# EAGLE design MOS-1 (EAGLE 8.5.2)
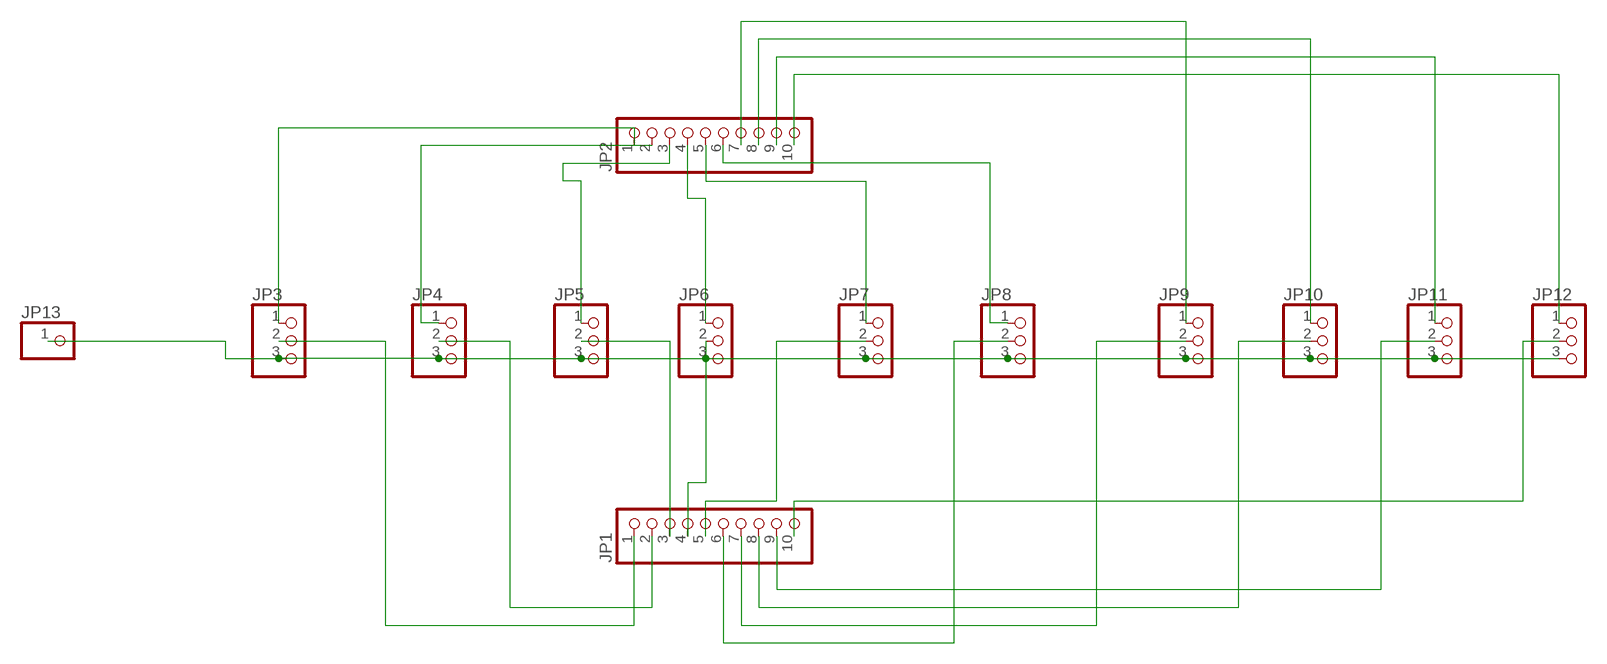
[diagram p0: schematic, sheet 1]

## Parts
JP1  PINHD-1X10  [1X10]
JP2  PINHD-1X10  [1X10]
JP3  PINHD-1X3  [1X03]
JP4  PINHD-1X3  [1X03]
JP5  PINHD-1X3  [1X03]
JP6  PINHD-1X3  [1X03]
JP7  PINHD-1X3  [1X03]
JP8  PINHD-1X3  [1X03]
JP9  PINHD-1X3  [1X03]
JP10  PINHD-1X3  [1X03]
JP11  PINHD-1X3  [1X03]
JP12  PINHD-1X3  [1X03]
JP13  PINHD-1X1  [1X01]

## Nets
N$1: JP3.3 JP4.3 JP5.3 JP6.3 JP7.3 JP8.3 JP9.3 JP10.3 JP11.3 JP12.3 JP13.1
N$2: JP2.1 JP3.1
N$3: JP2.2 JP4.1
N$4: JP2.3 JP5.1
N$5: JP2.4 JP6.1
N$6: JP2.5 JP7.1
N$7: JP2.6 JP8.1
N$8: JP2.7 JP9.1
N$9: JP2.8 JP10.1
N$10: JP2.9 JP11.1
N$11: JP2.10 JP12.1
N$12: JP1.1 JP3.2
N$13: JP1.2 JP4.2
N$14: JP1.3 JP5.2
N$15: JP1.4 JP6.2
N$16: JP1.5 JP7.2
N$17: JP1.6 JP8.2
N$18: JP1.7 JP9.2
N$19: JP1.8 JP10.2
N$20: JP1.9 JP11.2
N$21: JP1.10 JP12.2

## Library data of the parts
JP1 JP2 = pinhead:PINHD-1X10: PIN HEADER
JP3-JP12 = pinhead:PINHD-1X3: PIN HEADER
JP13 = pinhead:PINHD-1X1: PIN HEADER

## Net classes
0 default: width 1 mm, clearance 0.5 mm

## Board
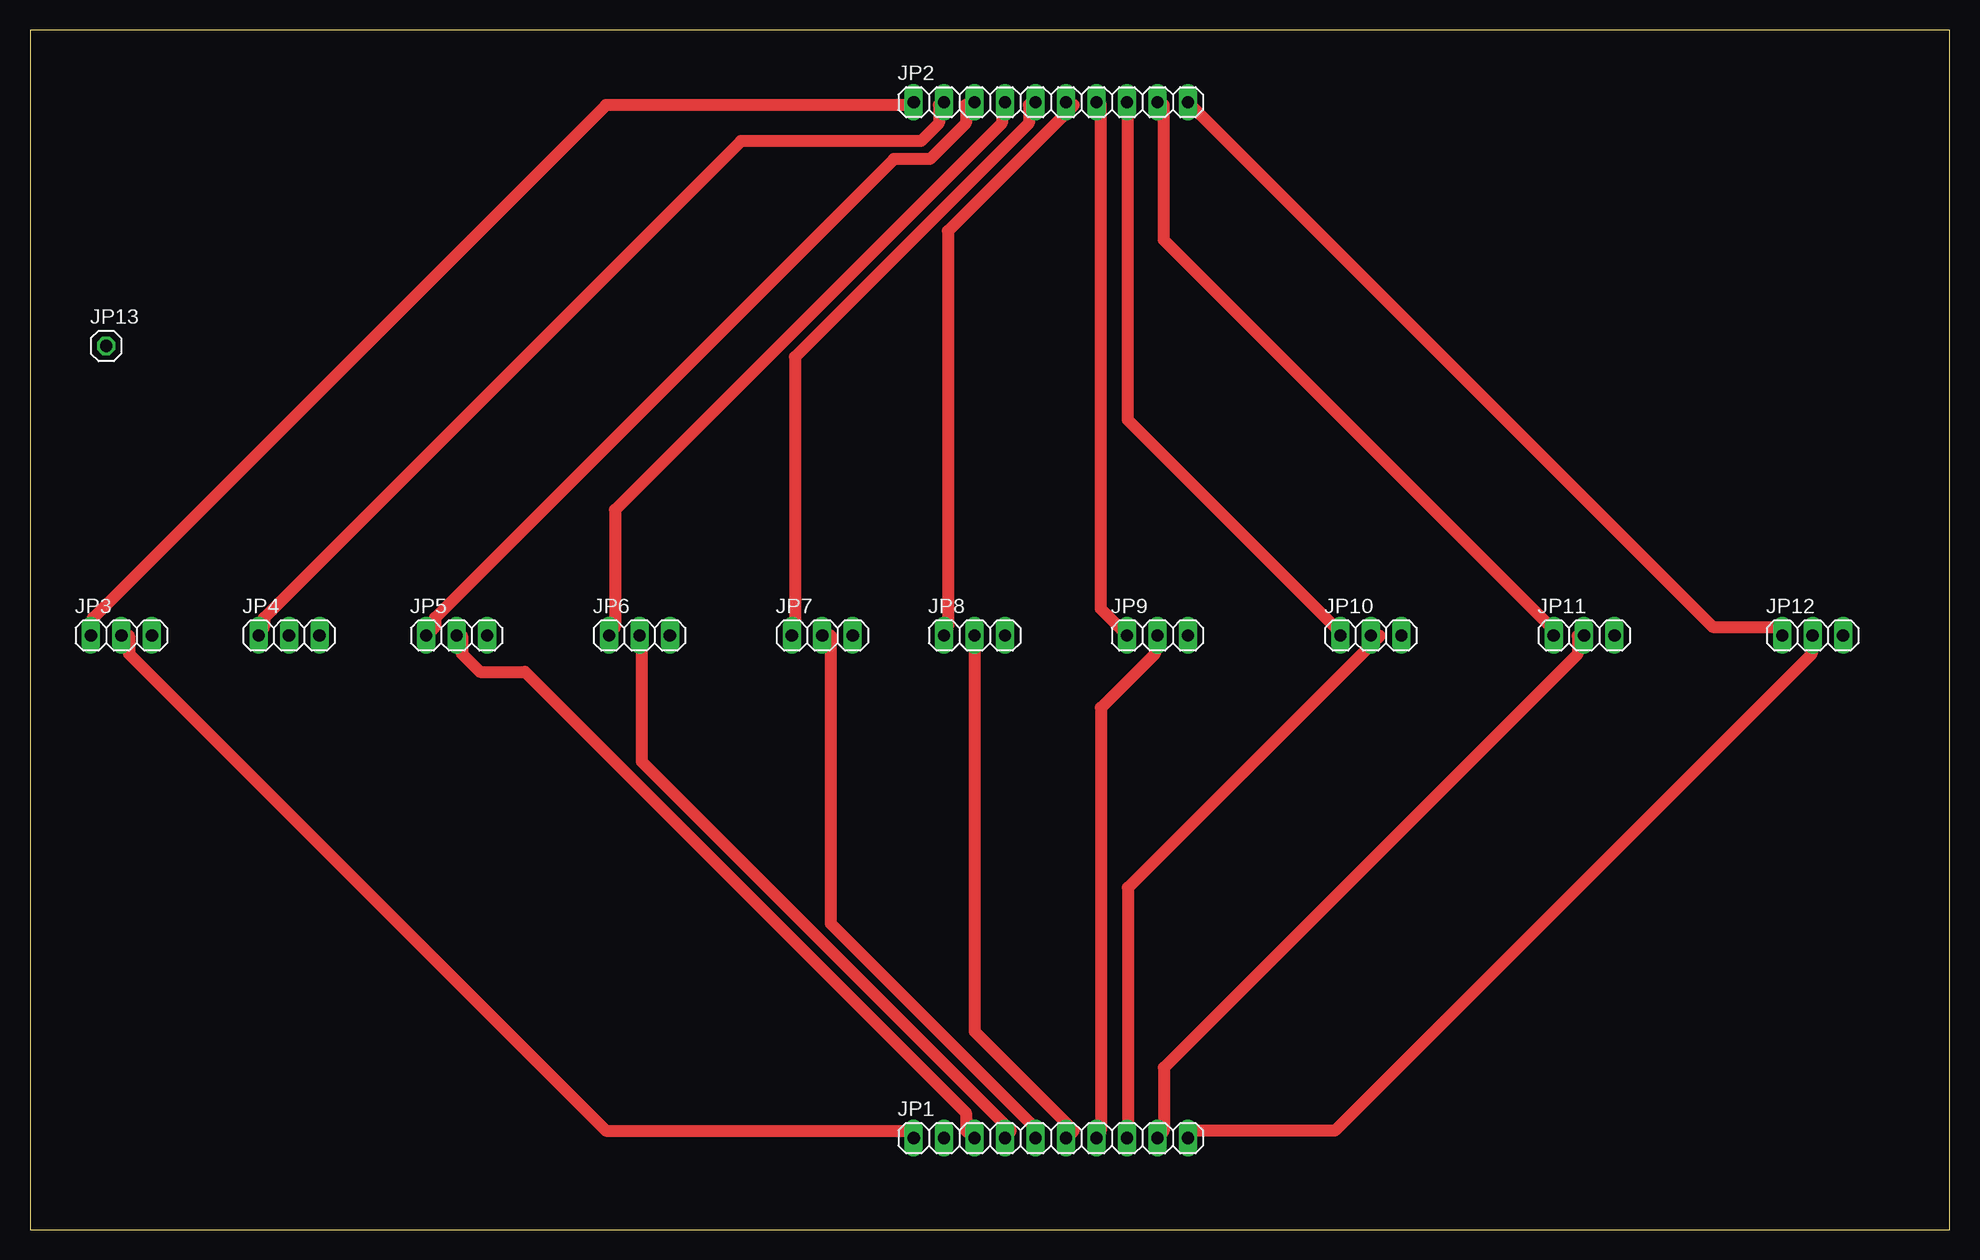
[diagram p1: board, top side]
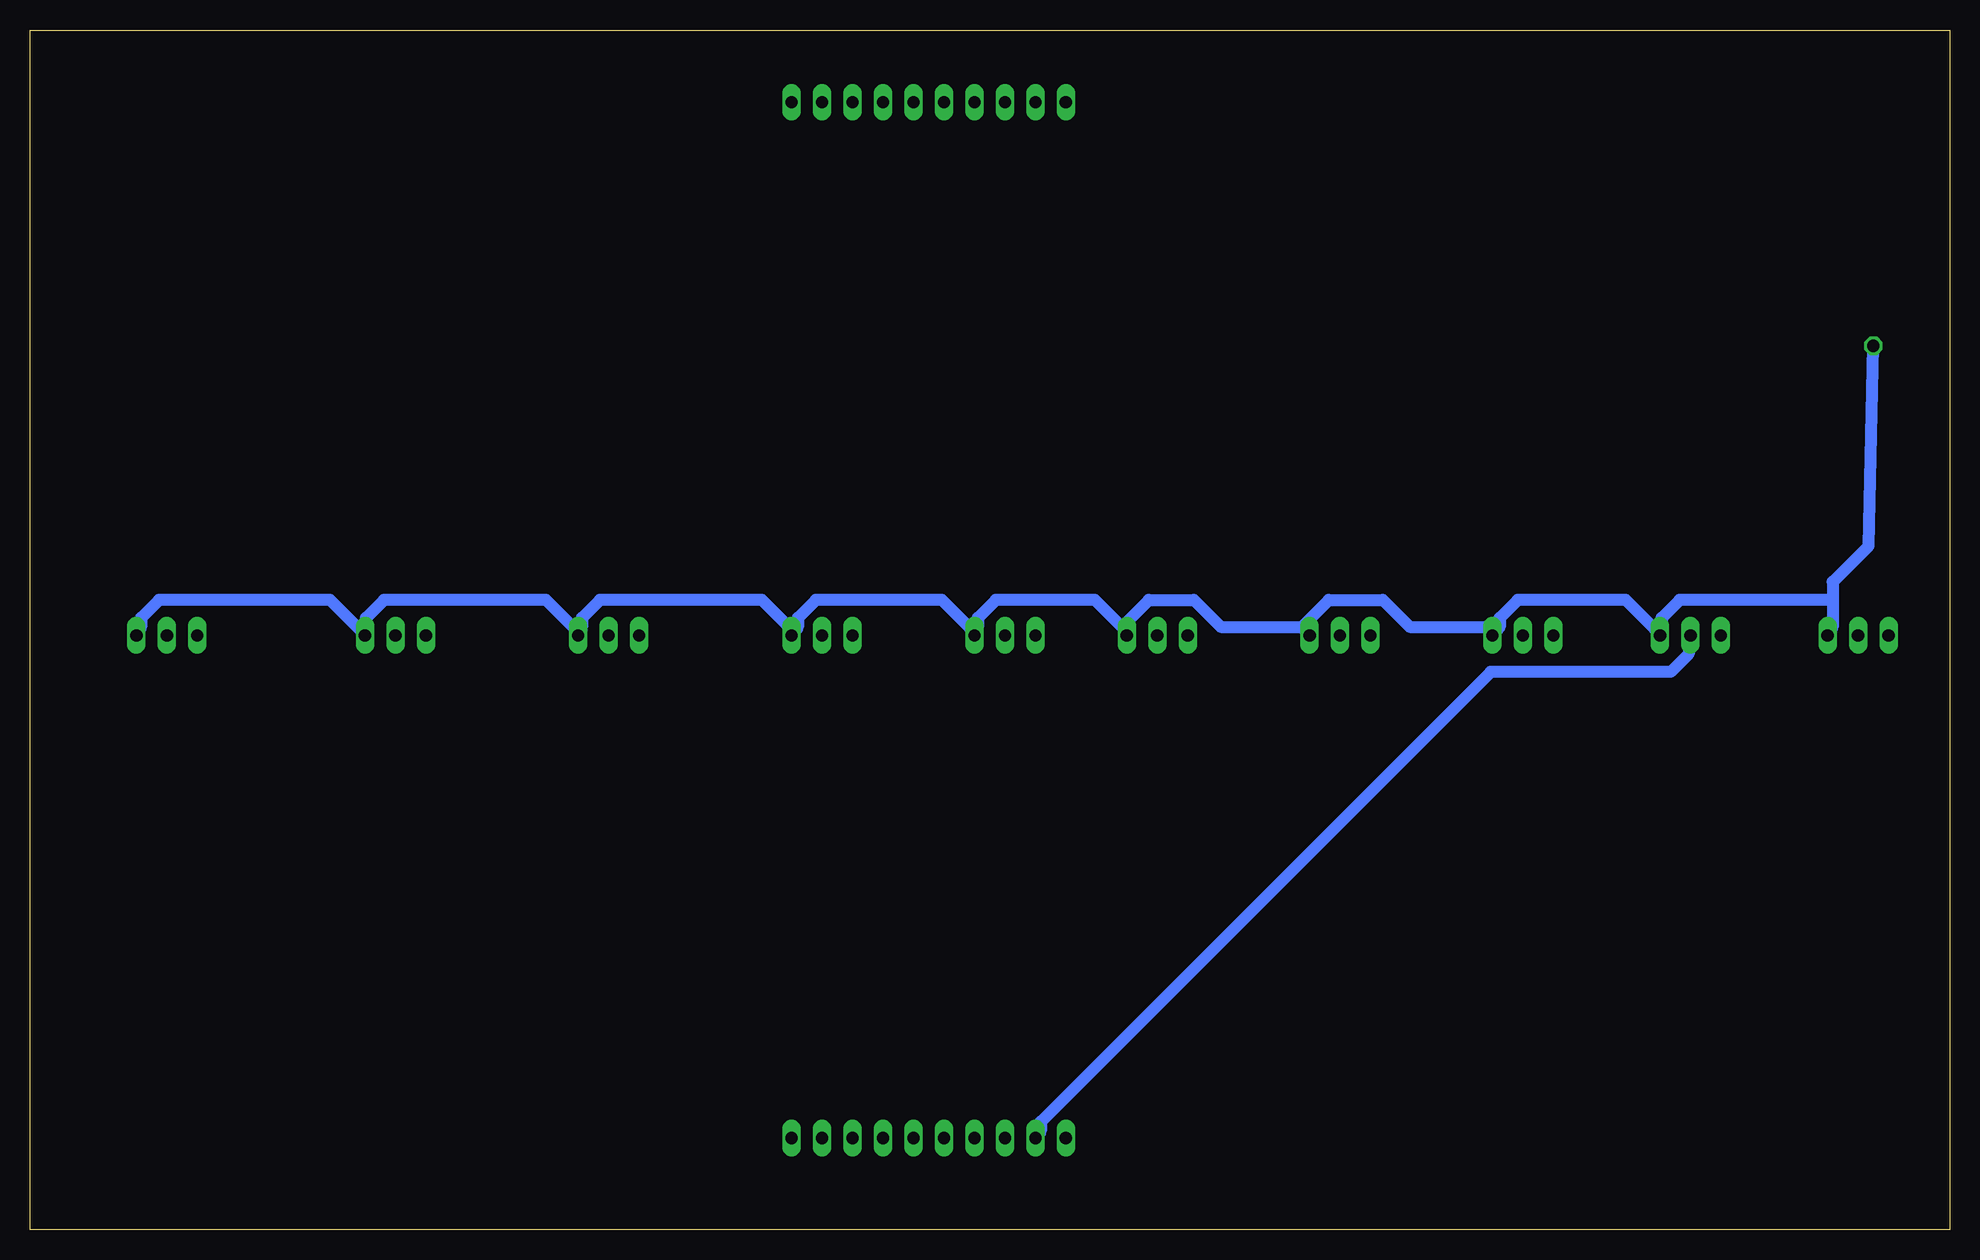
[diagram p2: board, bottom side, seen from below]

Size 160 x 100 mm. Coordinates in mm from the lower left corner, seen from the top.
Outline: 0,0 160,0 160,100 0,100 0,0
Copper layers (1*16): Top 0.035mm / dielectric 1.5mm / Bottom 0.035mm
Design rules "MOS-1": minimum track width 6mil, minimum drill 0.35mm, track to track 0.205mm, track to pad 0.205mm, pad to pad 0.205mm, via to via 0.205mm, smd to smd 6mil, copper to edge 40mil, drill to drill 6mil, minimum pad ring 10mil, minimum via ring 8mil, stop-mask expansion 4mil, vias tented up to drill 0mil, thermal gap 10mil

### Footprints (pad centres in the part's own frame; a part is rotated, then mirrored left to right if it is on the bottom)
1X10 = drill 1.016 long: 1 -11.43,0; 2 -8.89,0; 3 -6.35,0; 4 -3.81,0; 5 -1.27,0; 6 1.27,0; 7 3.81,0; 8 6.35,0; 9 8.89,0; 10 11.43,0
1X03 = drill 1.016 long: 1 -2.54,0; 2 0,0; 3 2.54,0
1X01 = drill 1.016 octagon: 1 0,0

### Placement (x,y rotation side)
JP1  85.09,7.62 0 top
JP2  85.09,93.98 0 top
JP3  7.62,49.53 0 top
JP4  21.59,49.53 0 top
JP5  35.56,49.53 0 top
JP6  50.8,49.53 0 top
JP7  66.04,49.53 0 top
JP8  78.74,49.53 0 top
JP9  93.98,49.53 0 top
JP10  111.76,49.53 0 top
JP11  129.54,49.53 0 top
JP12  148.59,49.53 0 top
JP13  6.35,73.66 0 top

### Tracks (layer width: path | path; a pad name or v marks a point on that pad's centre or on a via)
N$1
  Bottom 1: 9.75,52.5 9.75,54 6.75,57 JP13.1 | 9.75,52.5 9.75,50.25 JP3.3 | 9.75,52.5 22.5,52.5 24,51 24,50.25 JP4.3 24.75,50.25 27,52.5 36,52.5 37.5,51 37.5,50.25 JP5.3 38.25,50.25 45,50.25 47.25,52.5 51.75,52.5 54,50.25 | 54,50.25 60.75,50.25 63,52.5 66.75,52.5 69,50.25 | 69,50.25 71.25,52.5 79.5,52.5 81,51 81,50.25 JP8.3 81.75,50.25 84,52.5 94.5,52.5 96,51 96,50.25 JP9.3 96.75,50.25 99,52.5 112.5,52.5 114,51 114,50.25 JP10.3 114.75,50.25 117,52.5 130.5,52.5 132,51 132,50.25 JP11.3 132.75,50.25 135,52.5 149.25,52.5 150.75,51 150.75,50.25 JP12.3 | 69,50.25 JP7.3 | 54,50.25 JP6.3
N$2
  Top 1: JP3.1 5.25,50.25 5.25,51 48,93.75 73.5,93.75 JP2.1
N$3
  Top 1: JP4.1 19.5,50.25 19.5,51 59.25,90.75 74.25,90.75 75.75,92.25 75.75,93.75 JP2.2
N$4
  Top 1: JP5.1 33.75,50.25 33.75,51 72,89.25 75,89.25 78,92.25 78,93.75 JP2.3
N$5
  Top 1: JP6.1 48.75,50.25 48.75,60 81,92.25 81,93.75 JP2.4
N$6
  Top 1: JP7.1 63.75,50.25 63.75,72.75 83.25,92.25 83.25,93.75 JP2.5
N$7
  Top 1: JP8.1 76.5,50.25 76.5,83.25 87,93.75 JP2.6
N$8
  Top 1: JP2.7 89.25,93.75 89.25,51.75 90.75,50.25 JP9.1
N$9
  Top 1: JP2.8 91.5,93.75 91.5,67.5 108.75,50.25 JP10.1
N$10
  Top 1: JP2.9 94.5,93.75 94.5,82.5 126.75,50.25 JP11.1
N$11
  Top 1: JP2.10 140.25,50.25 145.5,50.25 JP12.1
N$12
  Top 1: JP1.1 73.5,8.25 48,8.25 8.25,48 8.25,49.5 JP3.2
N$13
  Bottom 1: JP1.2 75.75,8.25 75.75,9 38.25,46.5 23.25,46.5 21.75,48 21.75,49.5 JP4.2
N$14
  Top 1: JP1.3 78,8.25 78,9.75 41.25,46.5 37.5,46.5 36,48 36,49.5 JP5.2
N$15
  Top 1: JP6.2 51,49.5 51,39 81.75,8.25 JP1.4
N$16
  Top 1: JP7.2 66.75,49.5 66.75,25.5 84,8.25 JP1.5
N$17
  Top 1: JP8.2 78.75,49.5 78.75,16.5 87,8.25 JP1.6
N$18
  Top 1: JP1.7 89.25,8.25 89.25,43.5 93.75,48 93.75,49.5 JP9.2
N$19
  Top 1: JP1.8 91.5,8.25 91.5,28.5 112.5,49.5 JP10.2
N$20
  Top 1: JP1.9 94.5,8.25 94.5,13.5 129,48 129,49.5 JP11.2
N$21
  Top 1: JP1.10 96.75,8.25 108.75,8.25 148.5,48 148.5,49.5 JP12.2